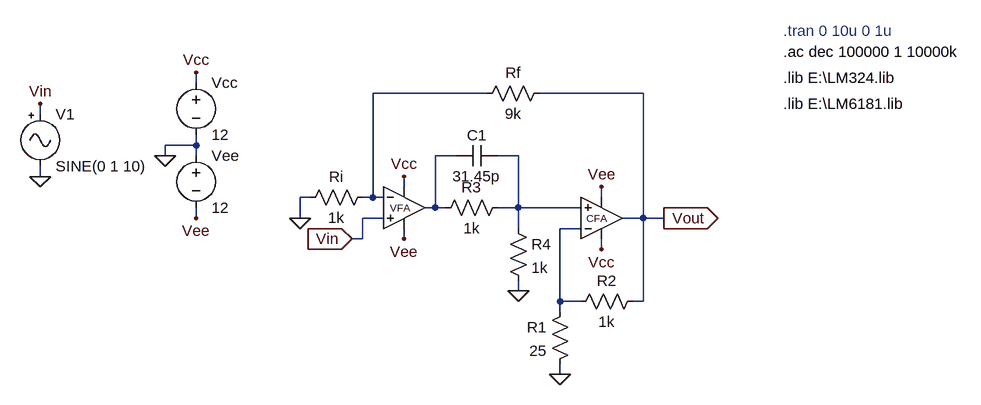
[diagram p0: schematic VFA-CFA_2.asc]
VFA-CFA_2.asc, the LTspice schematic file:
Version 4.1
SHEET 1 1556 680
WIRE 48 -80 48 -96
WIRE 496 -64 320 -64
WIRE 736 -64 576 -64
WIRE -192 -32 -192 -48
WIRE 48 16 48 0
WIRE 48 16 0 16
WIRE 0 32 0 16
WIRE 48 32 48 16
WIRE 448 32 416 32
WIRE 544 32 512 32
WIRE -192 64 -192 48
WIRE 368 80 368 64
WIRE 224 96 208 96
WIRE 320 96 320 -64
WIRE 320 96 304 96
WIRE 336 96 320 96
WIRE 672 96 672 80
WIRE 416 112 416 32
WIRE 416 112 400 112
WIRE 432 112 416 112
WIRE 544 112 544 32
WIRE 544 112 512 112
WIRE 640 112 544 112
WIRE 48 128 48 112
WIRE 208 128 208 96
WIRE 336 128 304 128
WIRE 736 128 736 -64
WIRE 736 128 704 128
WIRE 768 128 736 128
WIRE 544 144 544 112
WIRE 640 144 608 144
WIRE 304 160 304 128
WIRE 304 160 288 160
WIRE 368 160 368 144
WIRE 672 176 672 160
WIRE 544 240 544 224
WIRE 608 256 608 144
WIRE 640 256 608 256
WIRE 736 256 736 128
WIRE 736 256 720 256
WIRE 608 272 608 256
WIRE 608 368 608 352
FLAG 0 32 0
FLAG 48 -96 Vcc
FLAG 48 128 Vee
FLAG 208 128 0
FLAG 768 128 Vout
IOPIN 768 128 Out
FLAG -192 -48 Vin
FLAG 672 176 Vcc
FLAG 672 80 Vee
FLAG 368 64 Vcc
FLAG 368 160 Vee
FLAG 608 368 0
FLAG -192 64 0
FLAG 544 240 0
FLAG 288 160 Vin
IOPIN 288 160 In
SYMBOL res 320 80 R90
WINDOW 0 0 56 VBottom 2
WINDOW 3 32 56 VTop 2
SYMATTR InstName Ri
SYMATTR Value 1k
SYMBOL res 592 -80 R90
WINDOW 0 0 56 VBottom 2
WINDOW 3 32 56 VTop 2
SYMATTR InstName Rf
SYMATTR Value 9k
SYMBOL voltage 48 -96 R0
WINDOW 123 0 0 Left 0
WINDOW 39 0 0 Left 0
SYMATTR InstName Vcc
SYMATTR Value 12
SYMBOL voltage 48 16 R0
WINDOW 123 0 0 Left 0
WINDOW 39 0 0 Left 0
SYMATTR InstName Vee
SYMATTR Value 12
SYMBOL res 624 256 M0
SYMATTR InstName R1
SYMATTR Value 25
SYMBOL res 736 240 R90
WINDOW 0 0 56 VBottom 2
WINDOW 3 32 56 VTop 2
SYMATTR InstName R2
SYMATTR Value 1k
SYMBOL Misc\\signal -192 -48 R0
WINDOW 39 0 0 Left 0
SYMATTR InstName V1
SYMATTR Value SINE(0 1 10)
SYMATTR Value2 AC 1
SYMBOL res 416 128 R270
WINDOW 0 32 56 VTop 2
WINDOW 3 0 56 VBottom 2
SYMATTR InstName R3
SYMATTR Value 1k
SYMBOL res 528 128 R0
SYMATTR InstName R4
SYMATTR Value 1k
SYMBOL cap 512 16 R90
WINDOW 0 0 32 VBottom 2
WINDOW 3 32 32 VTop 2
SYMATTR InstName C1
SYMATTR Value 31.45p
SYMBOL OpAmps\\opamp2 368 48 R0
WINDOW 0 -22 64 Left 1
WINDOW 3 16 96 Invisible 2
SYMATTR InstName VFA
SYMATTR Value LM324
SYMBOL OpAmps\\opamp2 672 192 M180
WINDOW 0 -23 64 Left 1
WINDOW 3 16 96 Invisible 2
SYMATTR InstName CFA
SYMATTR Value LM6181/NS
TEXT 952 -160 Left 2 ;.tran 0 10u 0 1u
TEXT 952 -128 Left 2 !.ac dec 100000 1 10000k
TEXT 952 -88 Left 2 !.lib E:\\LM324.lib
TEXT 952 -48 Left 2 !.lib E:\\LM6181.lib

The netlist it stands for:
* VFA-CFA_2.asc
Ri N001 0 1k
Rf Vout N001 9k
Vcc Vcc 0 12
Vee 0 Vee 12
R1 N004 0 25
R2 Vout N004 1k
V1 Vin 0 SINE(0 1 10) AC 1
R3 N002 N003 1k
R4 N003 0 1k
C1 N003 N002 31.45p
X§VFA Vin N001 Vcc Vee N002 LM324  ; pins In+ In- V+ V- OUT
X§CFA N003 N004 Vcc Vee Vout LM6181/NS  ; pins In+ In- V+ V- OUT
* .tran 0 10u 0 1u
.ac dec 100000 1 10000k
.lib E:\LM324.lib
.lib E:\LM6181.lib
.backanno
.end